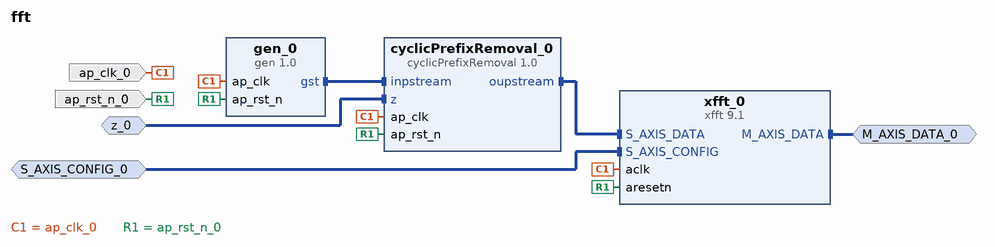
[diagram p0: block diagram of the top level]
# Vivado block design fft, xc7z020clg484-1, Vivado 2022.2.2
create_bd_design fft

create_bd_intf_port -mode Slave -vlnv xilinx.com:interface:axis_rtl:1.0 z_0
set_property -dict [list \
  CONFIG.HAS_TKEEP 0 \
  CONFIG.HAS_TLAST 0 \
  CONFIG.HAS_TREADY 1 \
  CONFIG.HAS_TSTRB 0 \
  CONFIG.LAYERED_METADATA undef \
  CONFIG.TDATA_NUM_BYTES 4 \
  CONFIG.TDEST_WIDTH 0 \
  CONFIG.TID_WIDTH 0 \
  CONFIG.TUSER_WIDTH 0 \
] [get_bd_intf_ports z_0]
create_bd_intf_port -mode Master -vlnv xilinx.com:interface:axis_rtl:1.0 M_AXIS_DATA_0
create_bd_intf_port -mode Slave -vlnv xilinx.com:interface:axis_rtl:1.0 S_AXIS_CONFIG_0
set_property -dict [list \
  CONFIG.HAS_TKEEP 0 \
  CONFIG.HAS_TLAST 0 \
  CONFIG.HAS_TREADY 1 \
  CONFIG.HAS_TSTRB 0 \
  CONFIG.LAYERED_METADATA undef \
  CONFIG.TDATA_NUM_BYTES 2 \
  CONFIG.TDEST_WIDTH 0 \
  CONFIG.TID_WIDTH 0 \
  CONFIG.TUSER_WIDTH 0 \
] [get_bd_intf_ports S_AXIS_CONFIG_0]
create_bd_port -dir I -type clk ap_clk_0
create_bd_port -dir I -type rst ap_rst_n_0

create_bd_cell -type ip -vlnv xilinx.com:ip:xfft:9.1 xfft_0
set_property -dict {CONFIG.aresetn true CONFIG.input_width 32} [get_bd_cells xfft_0]
create_bd_cell -type ip -vlnv xilinx.com:hls:gen:1.0 gen_0
create_bd_cell -type ip -vlnv xilinx.com:hls:cyclicPrefixRemoval:1.0 cyclicPrefixRemoval_0

# ---- connections ----

connect_bd_intf_net -intf_net S_AXIS_CONFIG_0_1 [get_bd_intf_ports S_AXIS_CONFIG_0] [get_bd_intf_pins xfft_0/S_AXIS_CONFIG]
connect_bd_intf_net [get_bd_intf_pins cyclicPrefixRemoval_0/oupstream] [get_bd_intf_pins xfft_0/S_AXIS_DATA]
connect_bd_intf_net [get_bd_intf_pins gen_0/gst] [get_bd_intf_pins cyclicPrefixRemoval_0/inpstream]
connect_bd_intf_net [get_bd_intf_ports M_AXIS_DATA_0] [get_bd_intf_pins xfft_0/M_AXIS_DATA]
connect_bd_intf_net -intf_net z_0_1 [get_bd_intf_ports z_0] [get_bd_intf_pins cyclicPrefixRemoval_0/z]
connect_bd_net -net ap_clk_0_1 [get_bd_ports ap_clk_0] [get_bd_pins gen_0/ap_clk] [get_bd_pins cyclicPrefixRemoval_0/ap_clk] [get_bd_pins xfft_0/aclk]
connect_bd_net -net ap_rst_n_0_1 [get_bd_ports ap_rst_n_0] \
  [get_bd_pins gen_0/ap_rst_n] [get_bd_pins cyclicPrefixRemoval_0/ap_rst_n] [get_bd_pins xfft_0/aresetn]

validate_bd_design
save_bd_design
